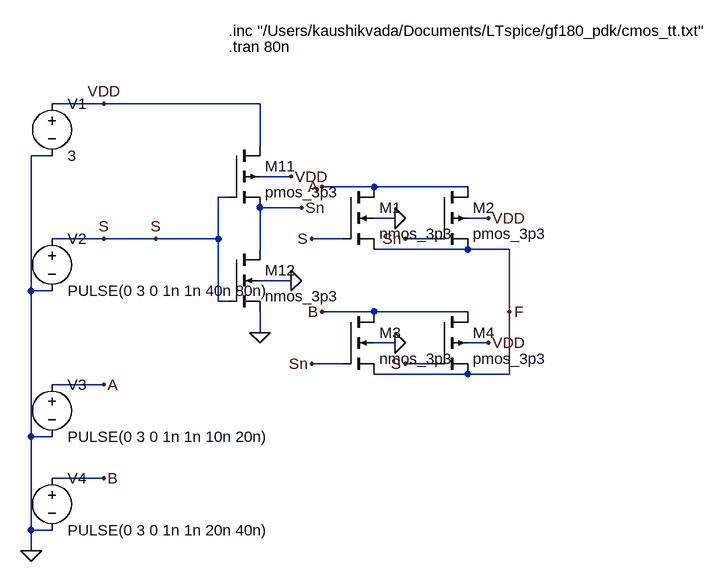
[diagram p0: schematic Q2_7_TG.asc]
Q2_7_TG.asc, the LTspice schematic file:
Version 4
SHEET 1 1000 750
WIRE 80 64 160 64
WIRE 80 144 48 144
WIRE 48 144 48 352
WIRE 80 272 160 272
WIRE 80 352 48 352
WIRE 48 352 48 576
WIRE 80 496 160 496
WIRE 80 576 48 576
WIRE 48 576 48 720
WIRE 80 640 160 640
WIRE 80 720 48 720
WIRE 48 720 48 752
WIRE 160 64 400 64
WIRE 400 64 400 128
WIRE 160 272 240 272
WIRE 240 272 336 272
WIRE 336 208 336 272
WIRE 336 208 352 208
WIRE 336 272 336 368
WIRE 336 368 352 368
WIRE 400 176 448 176
WIRE 400 224 400 288
WIRE 400 224 464 224
WIRE 400 336 448 336
WIRE 400 384 400 416
WIRE 496 192 576 192
WIRE 576 192 720 192
WIRE 496 384 576 384
WIRE 576 384 720 384
WIRE 576 288 720 288
WIRE 720 288 784 288
WIRE 576 480 720 480
WIRE 720 480 784 480
WIRE 784 288 784 480
WIRE 480 272 528 272
WIRE 624 272 672 272
WIRE 480 464 528 464
WIRE 624 464 672 464
WIRE 576 240 608 240
WIRE 720 240 752 240
WIRE 576 432 608 432
WIRE 720 432 752 432
FLAG 48 752 0
FLAG 160 272 S
FLAG 160 496 A
FLAG 160 640 B
FLAG 160 64 VDD
FLAG 464 224 Sn
FLAG 240 272 S
FLAG 448 176 VDD
FLAG 448 336 0
FLAG 400 416 0
FLAG 496 192 A
FLAG 496 384 B
FLAG 784 384 F
FLAG 480 272 S
FLAG 624 272 Sn
FLAG 480 464 Sn
FLAG 624 464 S
FLAG 608 240 0
FLAG 752 240 VDD
FLAG 608 432 0
FLAG 752 432 VDD
SYMBOL voltage 80 48 R0
SYMATTR InstName V1
SYMATTR Value 3
SYMBOL voltage 80 256 R0
SYMATTR InstName V2
SYMATTR Value PULSE(0 3 0 1n 1n 40n 80n)
SYMBOL voltage 80 480 R0
SYMATTR InstName V3
SYMATTR Value PULSE(0 3 0 1n 1n 10n 20n)
SYMBOL voltage 80 624 R0
SYMATTR InstName V4
SYMATTR Value PULSE(0 3 0 1n 1n 20n 40n)
SYMBOL pmos4 352 128 R0
SYMATTR InstName M11
SYMATTR Value pmos_3p3
SYMATTR SpiceLine W=4u L=1u
SYMBOL nmos4 352 288 R0
SYMATTR InstName M12
SYMATTR Value nmos_3p3
SYMATTR SpiceLine W=2u L=1u
SYMBOL nmos4 528 192 R0
SYMATTR InstName M1
SYMATTR Value nmos_3p3
SYMATTR SpiceLine W=2u L=1u
SYMBOL pmos4 672 192 R0
SYMATTR InstName M2
SYMATTR Value pmos_3p3
SYMATTR SpiceLine W=4u L=1u
SYMBOL nmos4 528 384 R0
SYMATTR InstName M3
SYMATTR Value nmos_3p3
SYMATTR SpiceLine W=2u L=1u
SYMBOL pmos4 672 384 R0
SYMATTR InstName M4
SYMATTR Value pmos_3p3
SYMATTR SpiceLine W=4u L=1u
TEXT 352 -48 Left 2 !.inc "/Users/kaushikvada/Documents/LTspice/gf180_pdk/cmos_tt.txt"
TEXT 352 -24 Left 2 !.tran 80n

The netlist it stands for:
* Q2_7_TG.asc
V1 VDD 0 3
V2 S 0 PULSE(0 3 0 1n 1n 40n 80n)
V3 A 0 PULSE(0 3 0 1n 1n 10n 20n)
V4 B 0 PULSE(0 3 0 1n 1n 20n 40n)
M11 VDD S Sn VDD pmos_3p3 W=4u L=1u
M12 Sn S 0 0 nmos_3p3 W=2u L=1u
M1 A S F 0 nmos_3p3 W=2u L=1u
M2 A Sn F VDD pmos_3p3 W=4u L=1u
M3 B Sn F 0 nmos_3p3 W=2u L=1u
M4 B S F VDD pmos_3p3 W=4u L=1u
.model NMOS NMOS
.model PMOS PMOS
.lib standard.mos
.inc "/Users/kaushikvada/Documents/LTspice/gf180_pdk/cmos_tt.txt"
.tran 80n
.backanno
.end